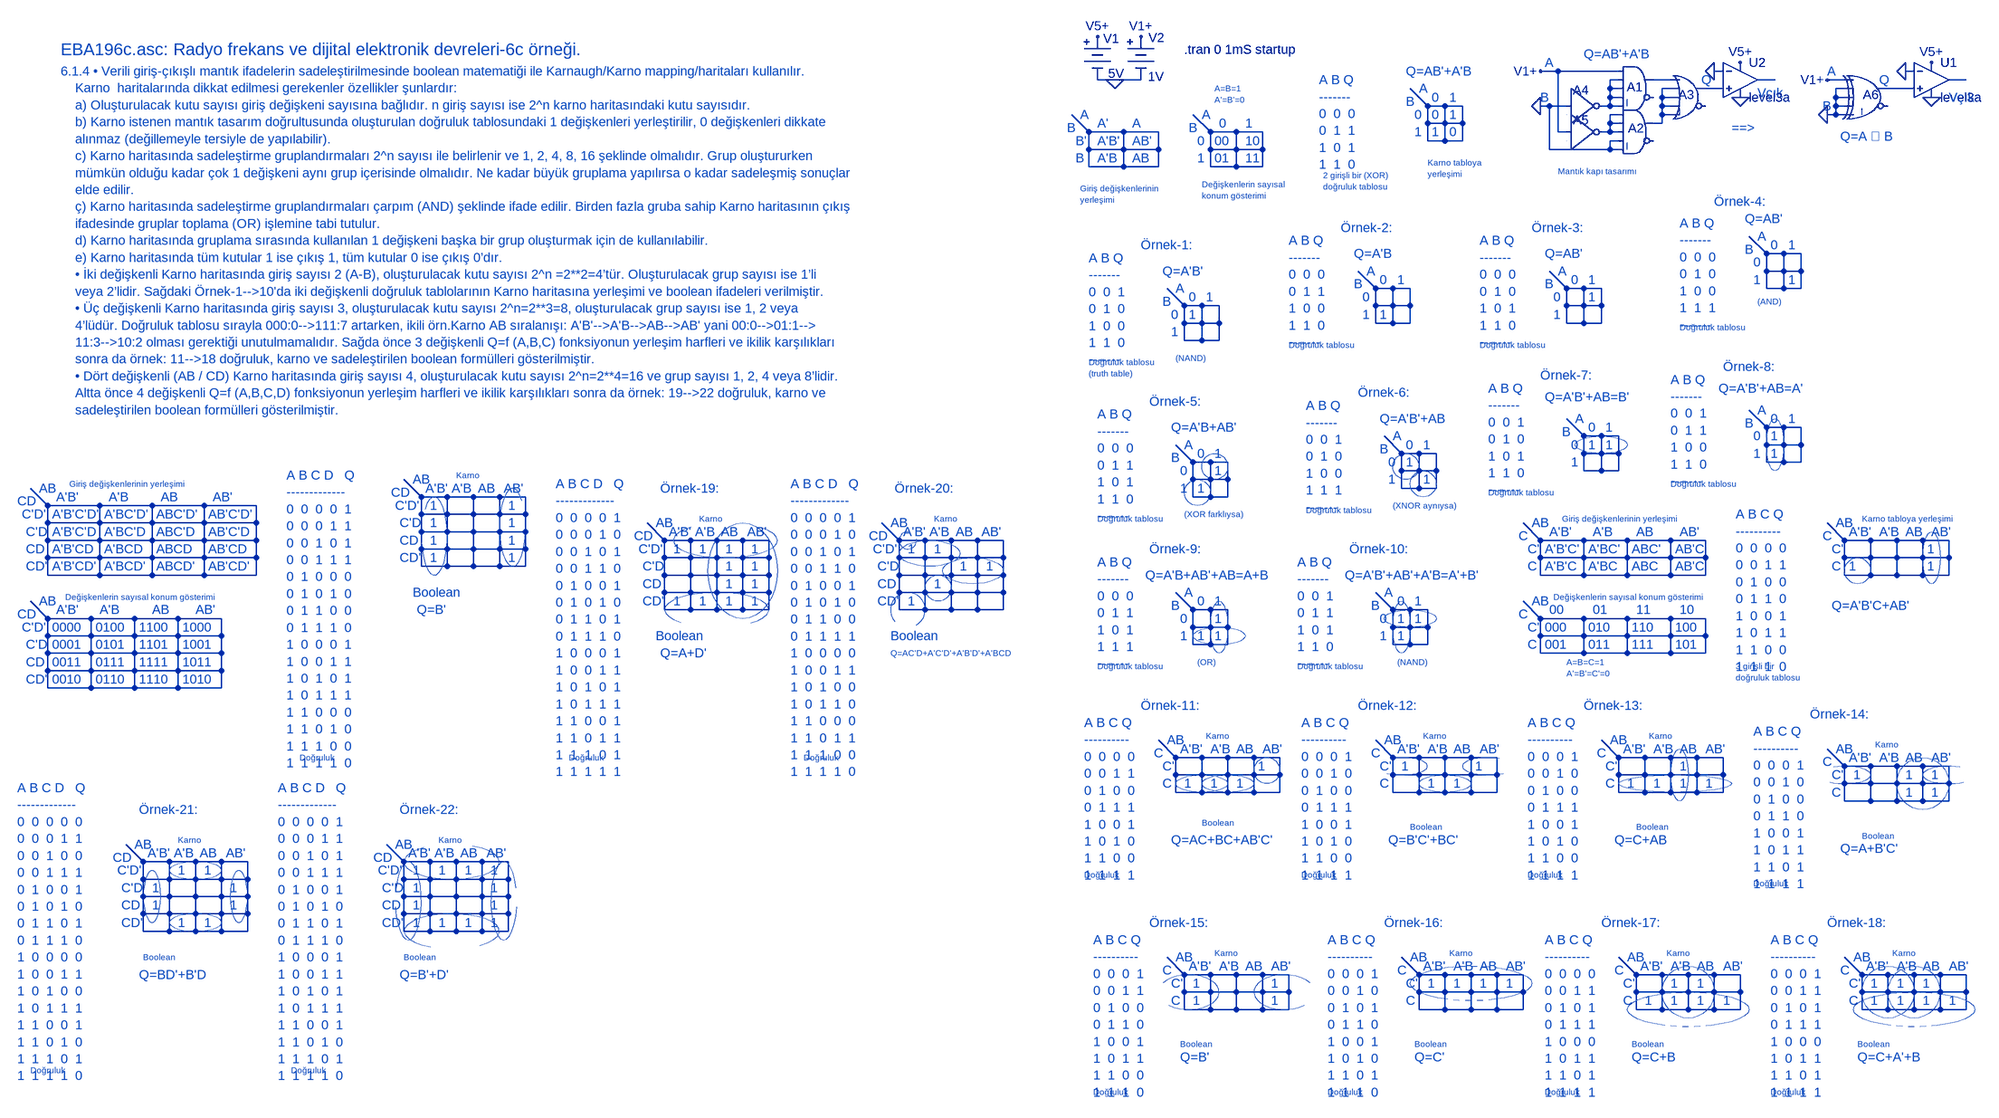
[diagram p0: schematic EBA196c.asc]
* EBA196c.asc
A1 V1+ N001 N001 N001 N001 0 N002 0 AND
A2 N009 N009 N009 0 0 0 N005 0 AND
A3 N002 N005 N005 N005 N005 0 N006 0 OR
A4 0 0 0 0 0 N001 0 0 BUF
A5 V1+ 0 0 0 0 N009 0 0 BUF
A6 V1+ 0 0 0 0 0 N007 0 XOR
V1 V5+ 0 5V
V2 V1+ 0 1V
XU1 N007 0 V5+ 0 N004 level3a  ; pins In+ In- V+ V- OUT
XU2 N006 0 V5+ 0 N003 level3a  ; pins In+ In- V+ V- OUT
* EBA196c.asc: Radyo frekans ve dijital elektronik devreleri-6c örneği.
* 6.1.4 • Verili giriş-çıkışlı mantık ifadelerin sadeleştirilmesinde boolean matematiği ile Karnaugh/Karno mapping/haritaları kullanılır.
*     Karno  haritalarında dikkat edilmesi gerekenler özellikler şunlardır:
*     a) Oluşturulacak kutu sayısı giriş değişkeni sayısına bağlıdır. n giriş sayısı ise 2^n karno haritasındaki kutu sayısıdır.
*     b) Karno istenen mantık tasarım doğrultusunda oluşturulan doğruluk tablosundaki 1 değişkenleri yerleştirilir, 0 değişkenleri dikkate
*     alınmaz (değillemeyle tersiyle de yapılabilir).
*     c) Karno haritasında sadeleştirme gruplandırmaları 2^n sayısı ile belirlenir ve 1, 2, 4, 8, 16 şeklinde olmalıdır. Grup oluştururken
*     mümkün olduğu kadar çok 1 değişkeni aynı grup içerisinde olmalıdır. Ne kadar büyük gruplama yapılırsa o kadar sadeleşmiş sonuçlar
*     elde edilir.
*     ç) Karno haritasında sadeleştirme gruplandırmaları çarpım (AND) şeklinde ifade edilir. Birden fazla gruba sahip Karno haritasının çıkış
*     ifadesinde gruplar toplama (OR) işlemine tabi tutulur.
*     d) Karno haritasında gruplama sırasında kullanılan 1 değişkeni başka bir grup oluşturmak için de kullanılabilir.
*     e) Karno haritasında tüm kutular 1 ise çıkış 1, tüm kutular 0 ise çıkış 0’dır.
*     • İki değişkenli Karno haritasında giriş sayısı 2 (A-B), oluşturulacak kutu sayısı 2^n =2**2=4’tür. Oluşturulacak grup sayısı ise 1’li
*     veya 2’lidir. Sağdaki Örnek-1-->10'da iki değişkenli doğruluk tablolarının Karno haritasına yerleşimi ve boolean ifadeleri verilmiştir.
*     • Üç değişkenli Karno haritasında giriş sayısı 3, oluşturulacak kutu sayısı 2^n=2**3=8, oluşturulacak grup sayısı ise 1, 2 veya
*     4’lüdür. Doğruluk tablosu sırayla 000:0-->111:7 artarken, ikili örn.Karno AB sıralanışı: A'B'-->A'B-->AB-->AB' yani 00:0-->01:1-->
*     11:3-->10:2 olması gerektiği unutulmamalıdır. Sağda önce 3 değişkenli Q=f (A,B,C) fonksiyonun yerleşim harfleri ve ikilik karşılıkları
*     sonra da örnek: 11-->18 doğruluk, karno ve sadeleştirilen boolean formülleri gösterilmiştir.
*     • Dört değişkenli (AB / CD) Karno haritasında giriş sayısı 4, oluşturulacak kutu sayısı 2^n=2**4=16 ve grup sayısı 1, 2, 4 veya 8’lidir.
*     Altta önce 4 değişkenli Q=f (A,B,C,D) fonksiyonun yerleşim harfleri ve ikilik karşılıkları sonra da örnek: 19-->22 doğruluk, karno ve
*     sadeleştirilen boolean formülleri gösterilmiştir.
* 0
* 1
* 0
* 1
* A
* B
* 00
* 01
* 10
* 11
* B'
* B
* A'
* A
* A
* B
* A'B'
* A'B
* AB'
* AB
* A=B=1
* A'=B'=0
* Giriş değişkenlerinin
* yerleşimi
* Değişkenlerin sayısal
* konum gösterimi
* A B Q
* -------
* 0  0  0
* 0  1  1
* 1  0  1
* 1  1  0
* 2 girişli bir (XOR)
* doğruluk tablosu
* 0
* 1
* 0
* 1
* B
* 0
* 1
* 1
* 0
* A
* Karno tabloya
* yerleşimi
* Q=AB'+A'B
* A
* B
* Q
* Q=AB'+A'B
* Mantık kapı tasarımı
* A
* B
* Q=A ⊕ B
* Q
* ==>
* A B Q
* -------
* 0  0  1
* 0  1  0
* 1  0  0
* 1  1  0
* -------
* Doğruluk tablosu
* (truth table)
* 0
* 1
* 0
* 1
* B
* 1
* A
* Q=A'B'
* (NAND)
* Örnek-1:
* A B Q
* -------
* 0  0  0
* 0  1  1
* 1  0  0
* 1  1  0
* -------
* Doğruluk tablosu
* 0
* 1
* 0
* 1
* B
* 1
* A
* Q=A'B
* Örnek-2:
* A B Q
* -------
* 0  0  0
* 0  1  0
* 1  0  1
* 1  1  0
* -------
* Doğruluk tablosu
* 0
* 1
* 0
* 1
* B
* 1
* A
* Q=AB'
* Örnek-3:
* A B Q
* -------
* 0  0  0
* 0  1  0
* 1  0  0
* 1  1  1
* -------
* Doğruluk tablosu
* 0
* 1
* 0
* 1
* B
* 1
* A
* Q=AB'
* Örnek-4:
* (AND)
* A B Q
* -------
* 0  0  0
* 0  1  1
* 1  0  1
* 1  1  0
* -------
* Doğruluk tablosu
* 0
* 1
* 0
* 1
* B
* 1
* A
* Q=A'B+AB'
* (XOR farklıysa)
* Örnek-5:
* 1
* A B Q
* -------
* 0  0  1
* 0  1  0
* 1  0  0
* 1  1  1
* -------
* Doğruluk tablosu
* 0
* 1
* 0
* 1
* B
* 1
* A
* Q=A'B'+AB
* (XNOR aynıysa)
* Örnek-6:
* 1
* A B Q
* -------
* 0  0  1
* 0  1  0
* 1  0  1
* 1  1  0
* -------
* Doğruluk tablosu
* 0
* 1
* 0
* 1
* B
* 1
* A
* Q=A'B'+AB=B'
* Örnek-7:
* 1
* A B Q
* -------
* 0  0  1
* 0  1  1
* 1  0  0
* 1  1  0
* -------
* Doğruluk tablosu
* 0
* 1
* 0
* 1
* B
* 1
* A
* Q=A'B'+AB=A'
* Örnek-8:
* 1
* A B Q
* -------
* 0  0  0
* 0  1  1
* 1  0  1
* 1  1  1
* -------
* Doğruluk tablosu
* 0
* 1
* 0
* 1
* B
* 1
* A
* Q=A'B+AB'+AB=A+B
* (OR)
* Örnek-9:
* 1
* 1
* A B Q
* -------
* 0  0  1
* 0  1  1
* 1  0  1
* 1  1  0
* -------
* Doğruluk tablosu
* 0
* 1
* 0
* 1
* B
* 1
* A
* Q=A'B'+AB'+A'B=A'+B'
* (NAND)
* Örnek-10:
* 1
* 1
.tran 0 1mS startup
* Vçık
* Vçık
* C'
* C
* A'B'
* A'B
* AB
* C
* A'B'C'
* A'B'C
* A'BC'
* A'BC
* A=B=C=1
* A'=B'=C'=0
* Giriş değişkenlerinin yerleşimi
* Değişkenlerin sayısal konum gösterimi
* A B C Q
* ----------
* 0  0  0  0
* 0  0  1  1
* 0  1  0  0
* 0  1  1  0
* 1  0  0  1
* 1  0  1  1
* 1  1  0  0
* 1  1  1  0
* 3 girişli bir
* doğruluk tablosu
* Karno tabloya yerleşimi
* Q=A'B'C+AB'
* AB
* AB'
* ABC'
* ABC
* AB'C'
* AB'C
* C'
* C
* 00
* 01
* AB
* C
* 000
* 001
* 010
* 011
* 11
* 10
* 110
* 111
* 100
* 101
* C'
* C
* A'B'
* A'B
* AB
* C
* 1
* AB
* AB'
* 1
* 1
* A B C Q
* ----------
* 0  0  0  0
* 0  0  1  1
* 0  1  0  0
* 0  1  1  1
* 1  0  0  1
* 1  0  1  0
* 1  1  0  0
* 1  1  1  1
* Doğruluk
* Karno
* Q=AC+BC+AB'C'
* C'
* C
* A'B'
* A'B
* AB
* C
* 1
* AB
* AB'
* 1
* Örnek-11:
* 1
* 1
* Boolean
* A B C Q
* ----------
* 0  0  0  1
* 0  0  1  0
* 0  1  0  0
* 0  1  1  1
* 1  0  0  1
* 1  0  1  0
* 1  1  0  0
* 1  1  1  1
* Doğruluk
* Karno
* Q=B'C'+BC'
* C'
* C
* A'B'
* A'B
* AB
* C
* AB
* AB'
* 1
* Örnek-12:
* 1
* 1
* Boolean
* 1
* A B C Q
* ----------
* 0  0  0  1
* 0  0  1  0
* 0  1  0  0
* 0  1  1  1
* 1  0  0  1
* 1  0  1  0
* 1  1  0  0
* 1  1  1  1
* Doğruluk
* Karno
* Q=C+AB
* C'
* C
* A'B'
* A'B
* AB
* C
* AB
* AB'
* Örnek-13:
* 1
* 1
* Boolean
* 1
* 1
* 1
* A B C Q
* ----------
* 0  0  0  1
* 0  0  1  0
* 0  1  0  0
* 0  1  1  0
* 1  0  0  1
* 1  0  1  1
* 1  1  0  1
* 1  1  1  1
* Doğruluk
* Karno
* Q=A+B'C'
* C'
* C
* A'B'
* A'B
* AB
* C
* AB
* AB'
* Örnek-14:
* 1
* 1
* Boolean
* 1
* 1
* 1
* A B C Q
* ----------
* 0  0  0  1
* 0  0  1  1
* 0  1  0  0
* 0  1  1  0
* 1  0  0  1
* 1  0  1  1
* 1  1  0  0
* 1  1  1  0
* Doğruluk
* Karno
* Q=B'
* C'
* C
* A'B'
* A'B
* AB
* C
* AB
* AB'
* Örnek-15:
* Boolean
* 1
* 1
* 1
* 1
* A B C Q
* ----------
* 0  0  0  1
* 0  0  1  0
* 0  1  0  1
* 0  1  1  0
* 1  0  0  1
* 1  0  1  0
* 1  1  0  1
* 1  1  1  0
* Doğruluk
* Karno
* Q=C'
* C'
* C
* A'B'
* A'B
* AB
* C
* AB
* AB'
* Örnek-16:
* Boolean
* 1
* 1
* 1
* 1
* A B C Q
* ----------
* 0  0  0  0
* 0  0  1  1
* 0  1  0  1
* 0  1  1  1
* 1  0  0  0
* 1  0  1  1
* 1  1  0  1
* 1  1  1  1
* Doğruluk
* Karno
* Q=C+B
* C'
* C
* A'B'
* A'B
* AB
* C
* AB
* AB'
* Örnek-17:
* Boolean
* 1
* 1
* 1
* 1
* 1
* 1
* A B C Q
* ----------
* 0  0  0  1
* 0  0  1  1
* 0  1  0  1
* 0  1  1  1
* 1  0  0  0
* 1  0  1  1
* 1  1  0  1
* 1  1  1  1
* Doğruluk
* Karno
* Q=C+A'+B
* C'
* C
* A'B'
* A'B
* AB
* C
* AB
* AB'
* Örnek-18:
* Boolean
* 1
* 1
* 1
* 1
* 1
* 1
* 1
* C'D'
* C'D
* A'B'
* A'B
* AB
* CD
* A'B'C'D'
* A'B'C'D
* A'BC'D'
* A'BC'D
* Giriş değişkenlerinin yerleşimi
* AB
* AB'
* ABC'D'
* ABC'D
* AB'C'D'
* AB'C'D
* CD
* CD'
* A'B'CD
* A'B'CD'
* A'BCD
* A'BCD'
* ABCD
* ABCD'
* AB'CD
* AB'CD'
* C'D'
* C'D
* A'B'
* A'B
* AB
* CD
* 0000
* 0001
* 0100
* 0101
* AB
* AB'
* 1100
* 1101
* 1000
* 1001
* CD
* CD'
* 0011
* 0010
* 0111
* 0110
* 1111
* 1110
* 1011
* 1010
* Değişkenlerin sayısal konum gösterimi
* A B C D   Q
* -------------
* 0  0  0  0  1
* 0  0  0  1  1
* 0  0  1  0  1
* 0  0  1  1  1
* 0  1  0  0  0
* 0  1  0  1  0
* 0  1  1  0  0
* 0  1  1  1  0
* 1  0  0  0  1
* 1  0  0  1  1
* 1  0  1  0  1
* 1  0  1  1  1
* 1  1  0  0  0
* 1  1  0  1  0
* 1  1  1  0  0
* 1  1  1  1  0
* Doğruluk
* C'D'
* C'D
* A'B'
* A'B
* AB
* CD
* 1
* AB
* AB'
* 1
* 1
* CD
* CD'
* 1
* 1
* 1
* 1
* Karno
* 1
* Q=B'
* Boolean
* A B C D   Q
* -------------
* 0  0  0  0  1
* 0  0  0  1  0
* 0  0  1  0  1
* 0  0  1  1  0
* 0  1  0  0  1
* 0  1  0  1  0
* 0  1  1  0  1
* 0  1  1  1  0
* 1  0  0  0  1
* 1  0  0  1  1
* 1  0  1  0  1
* 1  0  1  1  1
* 1  1  0  0  1
* 1  1  0  1  1
* 1  1  1  0  1
* 1  1  1  1  1
* Doğruluk
* C'D'
* C'D
* A'B'
* A'B
* AB
* CD
* AB
* AB'
* 1
* 1
* CD
* CD'
* 1
* 1
* 1
* Karno
* 1
* Q=A+D'
* Boolean
* Örnek-19:
* 1
* 1
* 1
* 1
* 1
* 1
* A B C D   Q
* -------------
* 0  0  0  0  1
* 0  0  0  1  0
* 0  0  1  0  1
* 0  0  1  1  0
* 0  1  0  0  1
* 0  1  0  1  0
* 0  1  1  0  0
* 0  1  1  1  1
* 1  0  0  0  0
* 1  0  0  1  1
* 1  0  1  0  0
* 1  0  1  1  0
* 1  1  0  0  0
* 1  1  0  1  1
* 1  1  1  0  0
* 1  1  1  1  0
* Doğruluk
* C'D'
* C'D
* A'B'
* A'B
* AB
* CD
* AB
* AB'
* 1
* CD
* CD'
* 1
* Karno
* 1
* Q=AC'D+A'C'D'+A'B'D'+A'BCD
* Boolean
* Örnek-20:
* 1
* 1
* 1
* A B C D   Q
* -------------
* 0  0  0  0  0
* 0  0  0  1  1
* 0  0  1  0  0
* 0  0  1  1  1
* 0  1  0  0  1
* 0  1  0  1  0
* 0  1  1  0  1
* 0  1  1  1  0
* 1  0  0  0  0
* 1  0  0  1  1
* 1  0  1  0  0
* 1  0  1  1  1
* 1  1  0  0  1
* 1  1  0  1  0
* 1  1  1  0  1
* 1  1  1  1  0
* Doğruluk
* C'D'
* C'D
* A'B'
* A'B
* AB
* CD
* 1
* AB
* AB'
* 1
* CD
* CD'
* 1
* 1
* Karno
* Q=BD'+B'D
* Boolean
* 1
* 1
* 1
* 1
* Örnek-21:
* A B C D   Q
* -------------
* 0  0  0  0  1
* 0  0  0  1  1
* 0  0  1  0  1
* 0  0  1  1  1
* 0  1  0  0  1
* 0  1  0  1  0
* 0  1  1  0  1
* 0  1  1  1  0
* 1  0  0  0  1
* 1  0  0  1  1
* 1  0  1  0  1
* 1  0  1  1  1
* 1  1  0  0  1
* 1  1  0  1  0
* 1  1  1  0  1
* 1  1  1  1  0
* Doğruluk
* C'D'
* C'D
* A'B'
* A'B
* AB
* CD
* 1
* AB
* AB'
* 1
* CD
* CD'
* 1
* 1
* Karno
* Q=B'+D'
* Boolean
* 1
* 1
* 1
* 1
* Örnek-22:
* 1
* 1
* 1
* 1
.backanno
.end